# EAGLE design LilyPad_USB_Plus_Standalone (EAGLE 7.7.0)
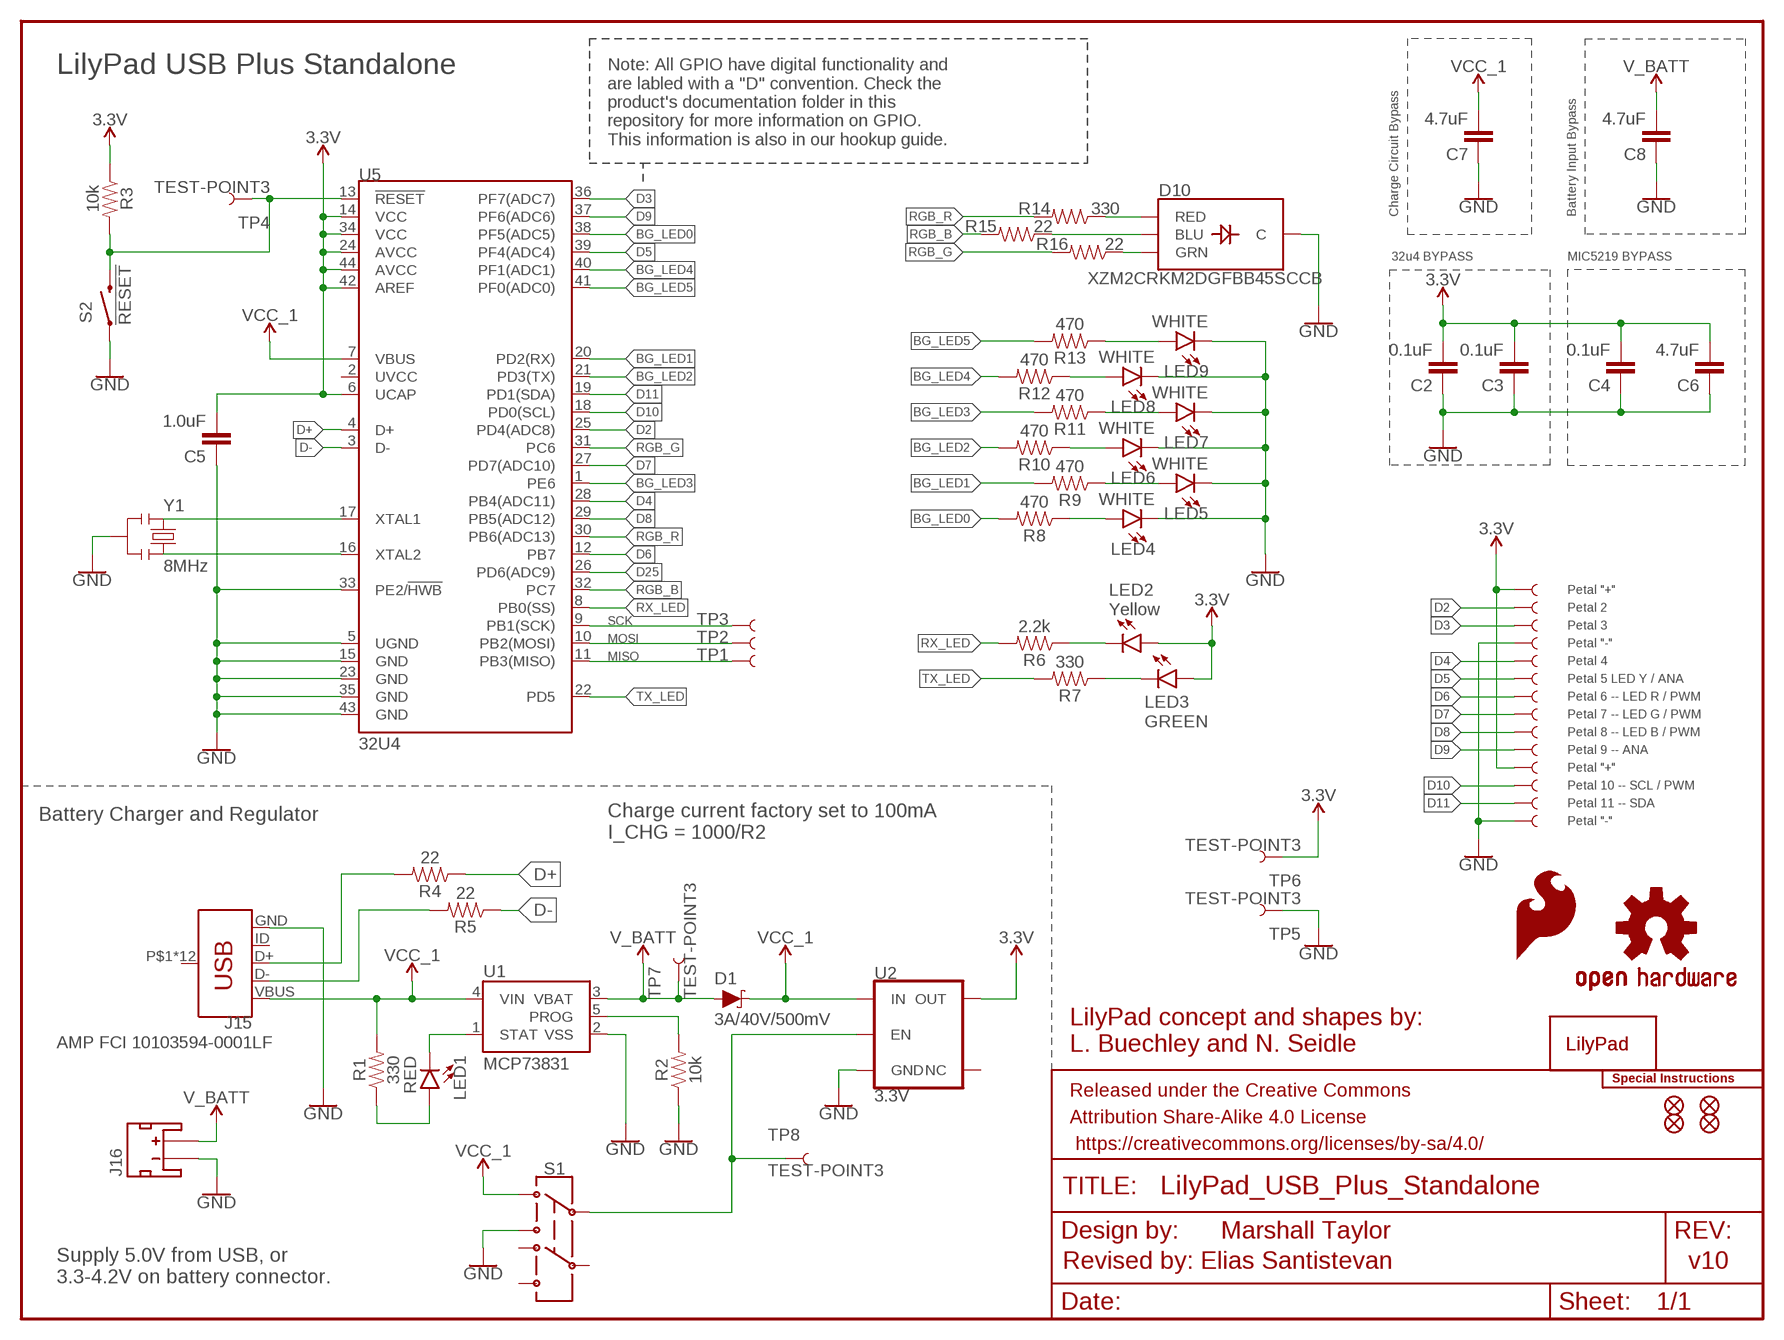
[diagram p0: schematic, sheet 1]

## Parts
C2  0.1uF  0.1UF-0402-16V-10%  [0402]
C3  0.1uF  0.1UF-0402-16V-10%  [0402]
C4  0.1uF  0.1UF-0402-16V-10%  [0402]
C5  1.0uF  1.0UF-0402-16V-10%  [0402]
C6  4.7uF  4.7UF0603  [0603]
C7  4.7uF  4.7UF0603  [0603]
C8  4.7uF  4.7UF0603  [0603]
D1  3A/40V/500mV  DIODE-SCHOTTKY-B340A  [SMA-DIODE]
D10  XZM2CRKM2DGFBB45SCCB  SUNLEDSMD1  [PLCC4SMDLED]
FRAME1  FRAME-LETTER  [CREATIVE_COMMONS]
J1  SEWTAP_LONG-2SIDE  [PETAL-LONG-1-2SIDE]
J2  SEWTAP_LONG-2SIDE  [PETAL-LONG-1-2SIDE]
J3  SEWTAP_LONG-2SIDE  [PETAL-LONG-1-2SIDE]
J4  SEWTAP_LONG-2SIDE  [PETAL-LONG-1-2SIDE]
J5  SEWTAP_LONG-2SIDE  [PETAL-LONG-1-2SIDE]
J6  SEWTAP_LONG-2SIDE  [PETAL-LONG-1-2SIDE]
J7  SEWTAP_LONG-2SIDE  [PETAL-LONG-1-2SIDE]
J8  SEWTAP_LONG-2SIDE  [PETAL-LONG-1-2SIDE]
J9  SEWTAP_LONG-2SIDE  [PETAL-LONG-1-2SIDE]
J10  SEWTAP_LONG-2SIDE  [PETAL-LONG-1-2SIDE]
J11  SEWTAP_LONG-2SIDE  [PETAL-LONG-1-2SIDE]
J12  SEWTAP_LONG-2SIDE  [PETAL-LONG-1-2SIDE]
J13  SEWTAP_LONG-2SIDE  [PETAL-LONG-1-2SIDE]
J14  SEWTAP_LONG-2SIDE  [PETAL-LONG-1-2SIDE]
J15  AMP FCI 10103594-0001LF  USB_MICRO-B_HALF_PTH  [USB-MICROB-PTH]
J16  JST_2MM_MALE  [JST-2-SMD]
JP1  FIDUCIALUFIDUCIAL  [MICRO-FIDUCIAL]
JP2  FIDUCIALUFIDUCIAL  [MICRO-FIDUCIAL]
JP3  FIDUCIALUFIDUCIAL  [MICRO-FIDUCIAL]
JP4  FIDUCIALUFIDUCIAL  [MICRO-FIDUCIAL]
LED1  RED  LED-RED0603  [LED-0603]
LED2  Yellow  LED-YELLOW0603  [LED-0603]
LED3  GREEN  LED-GREEN0603  [LED-0603]
LED4  WHITE  LED-WHITE0603  [LED-0603]
LED5  WHITE  LED-WHITE0603  [LED-0603]
LED6  WHITE  LED-WHITE0603  [LED-0603]
LED7  WHITE  LED-WHITE0603  [LED-0603]
LED8  WHITE  LED-WHITE0603  [LED-0603]
LED9  WHITE  LED-WHITE0603  [LED-0603]
LOGO1  SFE_LOGO_FLAME.2_INCH  [SFE_LOGO_FLAME_.2]
LOGO6  OSHW-LOGOS  [OSHW-LOGO-S]
R1  330  330OHM-0603-1/10W-1%  [0603]
R2  10k  10KOHM-0603-1/10W-1%  [0603]
R3  10k  10KOHM-0603-1/10W-1%  [0603]
R4  22  22OHM-0402-1/10W-1%  [0402]
R5  22  22OHM-0402-1/10W-1%  [0402]
R6  2.2k  2.2KOHM-0603-1/10W-1%  [0603]
R7  330  330OHM-0603-1/10W-1%  [0603]
R8  470  470OHM-0402-1/16W-5%  [0402]
R9  470  470OHM-0402-1/16W-5%  [0402]
R10  470  470OHM-0402-1/16W-5%  [0402]
R11  470  470OHM-0402-1/16W-5%  [0402]
R12  470  470OHM-0402-1/16W-5%  [0402]
R13  470  470OHM-0402-1/16W-5%  [0402]
R14  330  330OHM-0603-1/10W-1%  [0603]
R15  22  22OHM-0402-1/10W-1%  [0402]
R16  22  22OHM-0402-1/10W-1%  [0402]
S1  SWITCH-DPDT-SMD-AYZ0202  [SWITCH_DPDT_SMD_AYZ0202]
S2  !RESET  MOMENTARY-SWITCH-SPST-SMD-5.2-REDUNDANT  [TACTILE_SWITCH_SMD_5.2MM]
TP1  TEST-POINT3  [PAD.03X.03]
TP2  TEST-POINT3  [PAD.03X.03]
TP3  TEST-POINT3  [PAD.03X.03]
TP4  TEST-POINT3  [PAD.03X.03]
TP5  TEST-POINT3  [PAD.03X.03]
TP6  TEST-POINT3  [PAD.03X.03]
TP7  TEST-POINT3  [PAD.03X.03]
TP8  TEST-POINT3  [PAD.03X.03]
U1  MCP73831  [SOT23-5]
U2  3.3V  V_REG_AP2112K-3.3V  [SOT23-5]
U5  32U4  ATMEGA32U4_NOARDQFN3  [QFN-44-PAD_1:1-LESS_PASTE]
U$1  LILYLOGO_SHORT  [LILYPAD-WEARABLES_LOGO-LILYPAD]
U$13  LILYLOGO_SHORT  [LILYPAD-WEARABLES_LOGO-LILYPAD]
U$44  SPECIAL_INSTRUCTIONS-ORDERING  [ORDERING_INSTRUCTIONS]
Y1  8MHz  RESONATORSMD  [RESONATOR-SMD]

## Nets
3.3V: C2.2 C3.2 C4.2 C5.2 C6.2 J1.1 J11.1 LED2.A LED3.A R3.1 TP6.P$1 U2.5(OUT) U5.6(UCAP) U5.14(VCC) U5.24(AVCC) U5.34(VCC) U5.42(AREF) U5.44(AVCC)
BG_LED0: R8.2 U5.38(PF5(ADC5))
BG_LED1: R9.2 U5.20(PD2(RX))
BG_LED2: R10.2 U5.21(PD3(TX))
BG_LED3: R11.2 U5.1(PE6)
BG_LED4: R12.2 U5.40(PF1(ADC1))
BG_LED5: R13.2 U5.41(PF0(ADC0))
D2: J2.1 U5.25(PD4(ADC8))
D3: J3.1 U5.36(PF7(ADC7))
D4: J5.1 U5.28(PB4(ADC11))
D5: J6.1 U5.39(PF4(ADC4))
D6: J7.1 U5.12(PB7)
D7: J8.1 U5.27(PD7(ADC10))
D8: J9.1 U5.29(PB5(ADC12))
D9: J10.1 U5.37(PF6(ADC6))
D10: J12.1 U5.18(PD0(SCL))
D11: J13.1 U5.19(PD1(SDA))
D25: U5.26(PD6(ADC9))
D+: R4.1 U5.4(D+)
D-: R5.1 U5.3(D-)
GND: C2.1 C3.1 C4.1 C5.1 C6.1 C7.1 C8.1 D10.4(C) J4.1 J14.1 J15.GND J16.1(-) LED4.C LED5.C LED6.C LED7.C LED8.C LED9.C R2.1 S1.3 S2.1 S2.2 TP5.P$1 U1.2(VSS) U2.2(GND) U5.5(UGND) U5.15(GND) U5.23(GND) U5.33(PE2/!HWB) U5.35(GND) U5.43(GND) Y1.2
MISO: TP1.P$1 U5.11(PB3(MISO))
MOSI: TP2.P$1 U5.10(PB2(MOSI))
N$1: LED2.C R6.1
N$2: S1.2 TP8.P$1 U2.3(EN)
N$3: LED1.A R1.1
N$4: LED1.C U1.1(STAT)
N$5: U5.17(XTAL1) Y1.1
N$6: R2.2 U1.5(PROG)
N$7: U5.16(XTAL2) Y1.3
N$8: D10.2(GRN) R16.1
N$9: LED7.A R11.1
N$10: LED6.A R10.1
N$11: LED5.A R9.1
N$12: LED8.A R12.1
N$13: LED9.A R13.1
N$14: D10.3(BLU) R15.1
N$15: D10.1(RED) R14.1
N$18: LED4.A R8.1
N$19: J15.D- R5.2
N$20: J15.D+ R4.2
N$21: LED3.C R7.1
RESET: R3.2 S2.3 S2.4 TP4.P$1 U5.13(!RESET)
RGB_B: R15.2 U5.32(PC7)
RGB_G: R16.2 U5.31(PC6)
RGB_R: R14.2 U5.30(PB6(ADC13))
RX_LED: R6.2 U5.8(PB0(SS))
SCK: TP3.P$1 U5.9(PB1(SCK))
TX_LED: R7.2 U5.22(PD5)
V_BATT: C8.2 D1.A J16.2(+) TP7.P$1 U1.3(VBAT)
VCC_1: C7.2 D1.C J15.VBUS R1.2 S1.1 U1.4(VIN) U2.1(IN) U5.7(VBUS)
Unconnected: J15.ID J15.P$1(SHIELD) J15.P$2(SHIELD) J15.P$3(SHIELD) J15.P$4(SHIELD) J15.P$6(SHIELD) J15.P$8(SHIELD) J15.P$10(SHIELD) J15.P$12(SHIELD) J15.SHEILD2(SHIELD) J15.SHIELD J15.SHIELD3(SHIELD) J15.SHIELD4(SHIELD) J16.NC1(PAD1) J16.NC2(PAD2) S1.4 S1.5 S1.6 U2.4(NC) U5.2(UVCC)

## Notes on the sheet
- LilyPad USB Plus Standalone
- Note: All GPIO have digital functionality and 
  are labled with a "D" convention. Check the 
  product's documentation folder in this 
  repository for more information on GPIO. 
  This information is also in our hookup guide.
- Charge Circuit Bypass | Battery Input Bypass
- 32u4 BYPASS | MIC5219 BYPASS
- Petal "+"
- Petal 2
- Petal 3
- Petal "-"
- Petal 4
- Petal 5 LED Y / ANA
- Petal 6 -- LED R / PWM
- Petal 7 -- LED G / PWM
- Petal 8 -- LED B / PWM
- Petal 9 -- ANA
- Petal "+"
- Petal 10 -- SCL / PWM
- Petal 11 -- SDA
- Battery Charger and Regulator | Petal "-"
- Charge current factory set to 100mA
  I_CHG = 1000/R2
- LilyPad concept and shapes by:
  L. Buechley and N. Seidle
- Marshall Taylor
- Revised by: Elias Santistevan | v10
- Supply 5.0V from USB, or
  3.3-4.2V on battery connector.

## Library data of the parts
C2-C4 = SparkFun-Capacitors:0.1UF: 0.1µF ceramic capacitors A capacitor is a passive two-terminal electrical component used to store electrical energy temporarily in an electric field.; PROD_ID: CAP-12416
C5 = SparkFun-Capacitors:1.0UF: 1µF ceramic capacitors A capacitor is a passive two-terminal electrical component used to store electrical energy temporarily in an electric field.; PROD_ID: CAP-12417
C6-C8 = SparkFun-Capacitors:4.7UF: 4.7µF ceramic capacitors A capacitor is a passive two-terminal electrical component used to store electrical energy temporarily in an electric field.; PROD_ID: CAP-08280
D1 = SparkFun-DiscreteSemi:DIODE-SCHOTTKY: Schottky diode A Schottky diode is a semiconductor diode which has a low forward voltage drop and a very fast switching action.; PROD_ID: DIO-09886
D10 = SparkFun-LED:SUNLED: LED-RGB Common Cathode XZM2CRKM2DGFBB45SCCB Packages: PLCC4 SparkFun Products: Lilypad Prototyping Board <[https://www.sparkfun.com/products/9264]>; PROD_ID: DIO-13722
FRAME1 = SparkFun-Aesthetics:FRAME-LETTER: Schematic Frame - Letter Standard 8.5x11 US Letter frame
J1-J14 = LilyPad-Wearables:SEWTAP: SparkFun LilyPad Sew Taps Sewable connection points for LilyPad Boards SparkFun Products: LilyPad Arduino 328 Main Board <https://www.sparkfun.com/products/13342> LilyTiny <https://www.sparkfun.com/products/10899> LilyPad Power Supply <https://www.sparkfun.com/products/11259>
J15 = SparkFun-Connectors:USB_MICRO-B: USB Type Micro-B Connector Male/female and PTH/SMT variants SparkFun Products: SparkFun microB USB Breakout <https://www.sparkfun.com/products/12035> SparkFun USB microB Plug Breakout <https://www.sparkfun.com/products/10031> SparkFun ESP8266 Thing <https://www.sparkfun.com/products/13231>; PROD_ID: CONN-13711
J16 = SparkFun-Connectors:JST_2MM_MALE: JST 2MM MALE RA CONNECTOR Two pin, compact surface mount connector. Commonly used as a battery input connection point. We really like the solid locking feeling and high current rating on these small connectors. We use these all the time as battery connectors. Mates to single-cell LiPo batteries. Here is the connector we sell at SparkFun: JST Right Angle Connector - White <https://www.sparkfun.com/products/8612> (PRT-08612) Datasheet <http://www.sparkfun.com/datasheets/Prototyping/Connectors/JST-Horizontal.pdf> It was used on these SparkFun products: SparkFun MOSFET Power Controller <https://www.sparkfun.com/products/11214> (PRT-11214) SparkFun Battery Babysitter - LiPo Battery Manager <https://www.sparkfun.com/products/13777> (PRT-13777) And many, many others that required a lipo battery connection.; PROD_ID: CONN-11443; SF_ID: PRT-08612
JP1-JP4 = SparkFun:FIDUCIAL: Fiducial Alignment Points Various fiducial points for machine vision alignment.
LED1 = SparkFun-LED:LED-RED: Red SMD LED Used in manufacturing of most products at SparkFun Packages: 0603 - SMD 0603 package [Product Link] <http://docs.avagotech.com/docs/AV02-0551EN> 0603 SMART - SMD 0603 SMART package ( more efficient and expensive)[Product Link] <http://www.osram-os.com/Graphics/XPic2/00077099_0.pdf> 1206 - SMD1206 package [Product Link] <https://www.sparkfun.com/datasheets/DevTools/LilyPad/Q150OVS4.pdff> SparkFun Products: Pro Mini 328 -5V <https://www.sparkfun.com/products/821> RedBoard <https://www.sparkfun.com/products/12757> IOIO-OTG <https://www.sparkfun.com/products/13613>; PROD_ID: DIO-00819
LED2 = SparkFun-LED:LED-YELLOW: Yellow SMD LED Used in manufacturing several products at SparkFun. Packages: 0603 - SMD 0603 package[Product Link] <http://www.kingbrightusa.com/product.asp?catalog_name=LED&product_id=APT1608SYCK> 0603 -SMART - SMART SMD 0603 package (more efficient/more expensive) [Product Link] <http://www.osram-os.com/osram_os/en/products/product-catalog/led-light-emitting-diodes/smartled-0603/ly-l29k/index.jsp> LilyPad - SMD1206 package[Product Datasheet] <https://www.sparkfun.com/datasheets/DevTools/LilyPad/Q150YUS4.pdf> SparkFun Products: Blynk Board <https://www.sparkfun.com/products/13794> IOIO-OTG <https://www.sparkfun.com/products/13613> XBee Explorer Serial <https://www.sparkfun.com/products/13225>; PROD_ID: DIO-09003
LED3 = SparkFun-LED:LED-GREEN: Green SMD LED Used in manufacturing of various products at SparkFun Packages: 0603 - SMD 0603 package [Product Link] <http://www.futureelectronics.com/en/technologies/semiconductors/optoelectronics/leds/Pages/9894312-LTST-C190GKT.aspx?CrossPart=HSMG-C190&IM=0> LilyPad 1206 - SMD1206 LilyPad package [Product Link] <http://www.futureelectronics.com/en/Technologies/Product.aspx?ProductID=IN150NGHARVATEKCORPORATION2049943&IM=0> 1206 - SMD1206 package [Product Link] <http://www.futureelectronics.com/en/technologies/semiconductors/optoelectronics/leds/Pages/8315665-LTST-C150KGKT.aspx?IM=0> 1206 Bottom Mount -SMD 1206 Bottom Mount [Product Link] <http://www.digikey.com/product-detail/en/lite-on-inc/LTST-C230KGKT/160-1456-1-ND/386854> SparkFun Products: Pro Mini 328 -5V <https://www.sparkfun.com/products/821> RedBoard <https://www.sparkfun.com/products/12757> MP3 Trigger <https://www.sparkfun.com/products/13720> Makey Makey <https://www.sparkfun.com/products/11076>; PROD_ID: DIO-00821
LED4-LED9 = SparkFun-LED:LED-WHITE: White SMD LED Used in manufacturing several products at SparkFun. Packages: 0603 - Bright White SMD 0603 package[Product Link] <http://www.kingbrightusa.com/product.asp?catalog_name=LED&product_id=APT1608QWF/D> 1206 - Bright White SMD1206 package [Product Link] <http://www.kingbrightusa.com/product.asp?catalog_name=LED&product_id=APT3216QWF/D> 3014 - Super Bright SMD 3014 package [Datasheet] <http://www.lumileds.com/uploads/459/DS208-pdf> SparkFun Products: Blackberry Trackballer Breakout <https://www.sparkfun.com/products/13169> Digital SandBox <https://www.sparkfun.com/products/12651>; PROD_ID: DIO-09004
LOGO1 = SparkFun-Aesthetics:SFE_LOGO_FLAME: SparkFun Flame Logo This is the SparkFun flame logo. The logo on the schematic will always be the same size; the package variant is the height of the flame. Default layer for the logo on the board is tSilk.
LOGO6 = SparkFun-Aesthetics:OSHW-LOGO: Open-Source Hardware (OSHW) Logo This logo indicates the piece of hardware it is found on incorporates a OSHW license and/or adheres to the definition of open source hardware found here: http://freedomdefined.org/OSHW
R1 R7 R14 = SparkFun-Resistors:330OHM: 330Ω resistor A resistor is a passive two-terminal electrical component that implements electrical resistance as a circuit element. Resistors act to reduce current flow, and, at the same time, act to lower voltage levels within circuits. - Wikipedia; PROD_ID: RES-00818
R2 R3 = SparkFun-Resistors:10KOHM: 10kΩ resistor A resistor is a passive two-terminal electrical component that implements electrical resistance as a circuit element. Resistors act to reduce current flow, and, at the same time, act to lower voltage levels within circuits. - Wikipedia; PROD_ID: RES-00824
R4 R5 R15 R16 = SparkFun-Resistors:22OHM: 22Ω resistor A resistor is a passive two-terminal electrical component that implements electrical resistance as a circuit element. Resistors act to reduce current flow, and, at the same time, act to lower voltage levels within circuits. - Wikipedia; PROD_ID: RES-12427
R6 = SparkFun-Resistors:2.2KOHM: 2.2kΩ resistor A resistor is a passive two-terminal electrical component that implements electrical resistance as a circuit element. Resistors act to reduce current flow, and, at the same time, act to lower voltage levels within circuits. - Wikipedia; PROD_ID: RES-08272
R8-R13 = SparkFun-Resistors:470OHM: 470Ω resistor A resistor is a passive two-terminal electrical component that implements electrical resistance as a circuit element. Resistors act to reduce current flow, and, at the same time, act to lower voltage levels within circuits. - Wikipedia; PROD_ID: RES-13829
S1 = SparkFun-Switches:SWITCH-DPDT: Double-Pole, Double-Throw (DPDT) Switch Double-pole, double-throw switches. Variant Overview PTH-GPI-152-3013 Used on SparkFun Geiger Counter <https://www.sparkfun.com/products/11345> SMD-AY0202 Surface Mount DPDT Switch <https://www.sparkfun.com/products/597> (COM-00597) Used on e.g. LilyPad Arduino USB - ATmega32U4 Board <https://www.sparkfun.com/products/12049>; PROD_ID: SWCH-08179; SF_SKU: COM-00597
S2 = SparkFun-Switches:MOMENTARY-SWITCH-SPST: Momentary Switch (Pushbutton) - SPST Normally-open (NO) SPST momentary switches (buttons, pushbuttons). Variants PTH-12MM - 12mm square, through-hole Momentary Pushbutton Switch - 12mm Square <https://www.sparkfun.com/products/9190> (COM-09190) PTH-6.0MM, PTH-6.0MM-KIT - 6.0mm square, through-hole Mini Pushbutton Switch <https://www.sparkfun.com/products/97> (COM-00097) KIT package intended for soldering kit's - only one side of pads' copper is exposed. PTH-RIGHT-ANGLE-KIT - Right-angle, through-hole Right Angle Tactile Button <https://www.sparkfun.com/products/10791> - Used on SparkFun BigTime Watch Kit <https://www.sparkfun.com/products/11734> SMD-12MM - 12mm square, surface-mount Tactile Button - SMD (12mm) <https://www.sparkfun.com/products/12993> (COM-12993) Used on SparkFun PicoBoard <https://www.sparkfun.com/products/11888> SMD-4.5MM - 4.5mm Square Trackball Switch Used on SparkFun Blackberry Trackballer Breakout <https://www.sparkfun.com/products/13169> SMD-4.6MMX2.8MM - 4.60mm x 2.80mm, surface mount Used on SparkFun SAMD21 Mini Breakout <https://www.sparkfun.com/products/13664> SMD-5.2MM, SMD-5.2-REDUNDANT - 5.2mm square, surface-mount Mini Pushbutton Switch - SMD <https://www.sparkfun.com/products/8720> (COM-08720) Used on Arduino Pro Mini <https://www.sparkfun.com/products/11114> REDUNDANT package connects both switch circuits together SMD-6.0X3.5MM - 6.0 x 3.5mm, surface mount Momentary Reset Switch SMD <https://www.sparkfun.com/products/8229> (COM-08229) SMD-6.2MM-TALL - 6.2mm square, surface mount Tactile Button - SMD (6mm) <https://www.sparkfun.com/products/12992> Used on SparkFun Digital Sandbox <https://www.sparkfun.com/products/12651> SMD-RIGHT-ANGLE - Right-angle, surface mount Used on SparkFun Block for Intel® Edison - Arduino <https://www.sparkfun.com/products/13036>; PROD_ID: SWCH-08247; SF_SKU: COM-08720
TP1-TP8 = SparkFun-Connectors:TEST-POINT: SparkFun Test Points Bare copper test points for troubleshooting or In-Circuit-Testing. These are used by our Production team for verifying production board runs using pogo-pins on test beds. SparkFun Products: SparkFun LSM9DS1 Breakout <https://www.sparkfun.com/products/13284> SparkFun PSOC <https://www.sparkfun.com/products/13714> SparkFun Load Cell Amplifier <https://www.sparkfun.com/products/13879>
U1 = SparkFun-PowerIC:MCP73831: Miniature single cell, fully integrated Li-Ion, Li-polymer charge management controller http://ww1.microchip.com/downloads/en/DeviceDoc/21984a.pdf; PROD_ID: IC-09995
U2 = SparkFun-IC-Power:V_REG_AP2112: AP2112 - 600mA CMOS LDO Regulator w/ Enable The AP2112 is CMOS process low dropout linear regulator with enable function, the regulator delivers a guaranteed 600mA (min.) continuous load current. Features Output Voltage Accuracy: ±1.5% Output Current: 600mA (Min.) Foldback Short Current Protection: 50mA Enable Function to Turn ON/OFF VOUT Low Dropout Voltage (3.3V): 250mV (Typ.) @IOUT=600mA Excellent Load Regulation: 0.2%/A (Typ.) Excellent Line Regulation: 0.02%/V (Typ.) Low Quiescent Current: 55μA (Typ.) Low Standby Current: 0.01μA (Typ.) Low Output Noise: 50μVRMS PSRR: 100Hz -65dB, 1kHz -65dB OTSD Protection Stable with 1.0μF Flexible Cap: Ceramic, Tantalum and Aluminum Electrolytic Operation Temperature Range: -40°C to 85°C ESD: MM 400V, HBM 4000V; PROD_ID: VREG-12457
U5 = SparkFun-IC-Microcontroller:ATMEGA32U4_NOARD: Atmel MCU, 32KByte Atmel 44-pin 8-bit Microcontroller with 32KBytes of ISP Flash and USB Controller Datasheet <http://cdn.sparkfun.com/datasheets/Dev/Arduino/Boards/ATMega32U4.pdf> SparkFun Products LilyPad Arduino USB - ATmega32U4 Board <https://www.sparkfun.com/products/12049> (DEV-12049) Pro Micro - 5V/16MHz <https://www.sparkfun.com/products/12640> (DEV-12640) Pro Micro - 3.3V/8MHz <https://www.sparkfun.com/products/12587> (DEV-12587) Fio v3 - ATmega32U4 <https://www.sparkfun.com/products/11520> (DEV-11520) Qduino Mini <https://www.sparkfun.com/products/13614> (DEV-13614) Makey Makey - Standard Kit <https://www.sparkfun.com/products/11511> (WIG-11511) Makey Makey Deluxe Kit <https://www.sparkfun.com/products/11519> (WIG-11519); PROD_ID: IC-10828
U$1 U$13 = newLilypadParts:LILYLOGO_SHORT
U$44 = SparkFun-Aesthetics:SPECIAL_INSTRUCTIONS: Special Ordering/Production Instructions Alert Symbol for special PCB ordering instructions or unique production process warnings. Ordering Instructions Production Instructions Types of information that should be added to box: Copper weight Soldermask color Silk color PCB thickness Number of layers PCB Standard: 1.6mm FR4 1 oz copper immersion silver plating red soldermask white silkscreen Types of information that should be added to box: Special wash requirements Depaneling instructions Humidification Glue curing Default text settings: 0.07 inch 9% ratio 50% line distance
Y1 = SparkFun-FreqCtrl:RESONATOR: Resonator Small SMD resonator. This is the itty bitty 10/20MHz resonators with built in caps. CSTCE10M0G55 and CSTCE20M0V53. Footprint has been reviewed closely but hasn't been tested yet.; PROD_ID: XTAL-08895

## Board
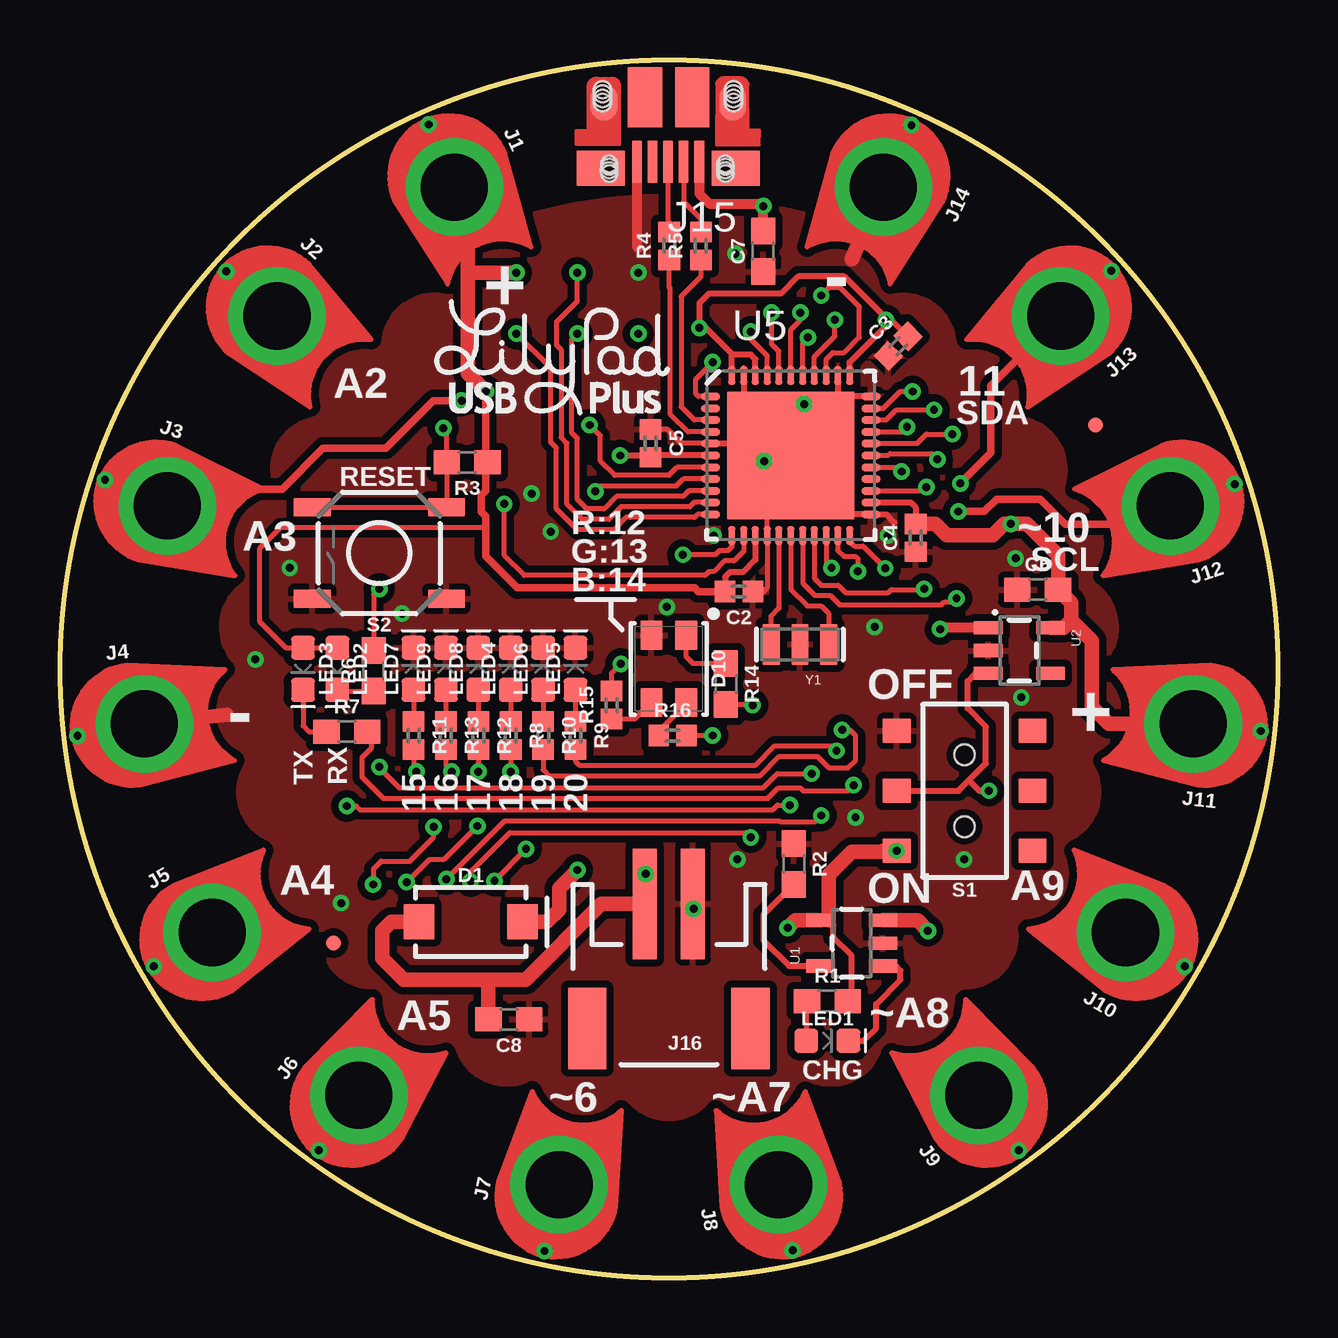
[diagram p1: board, top side]
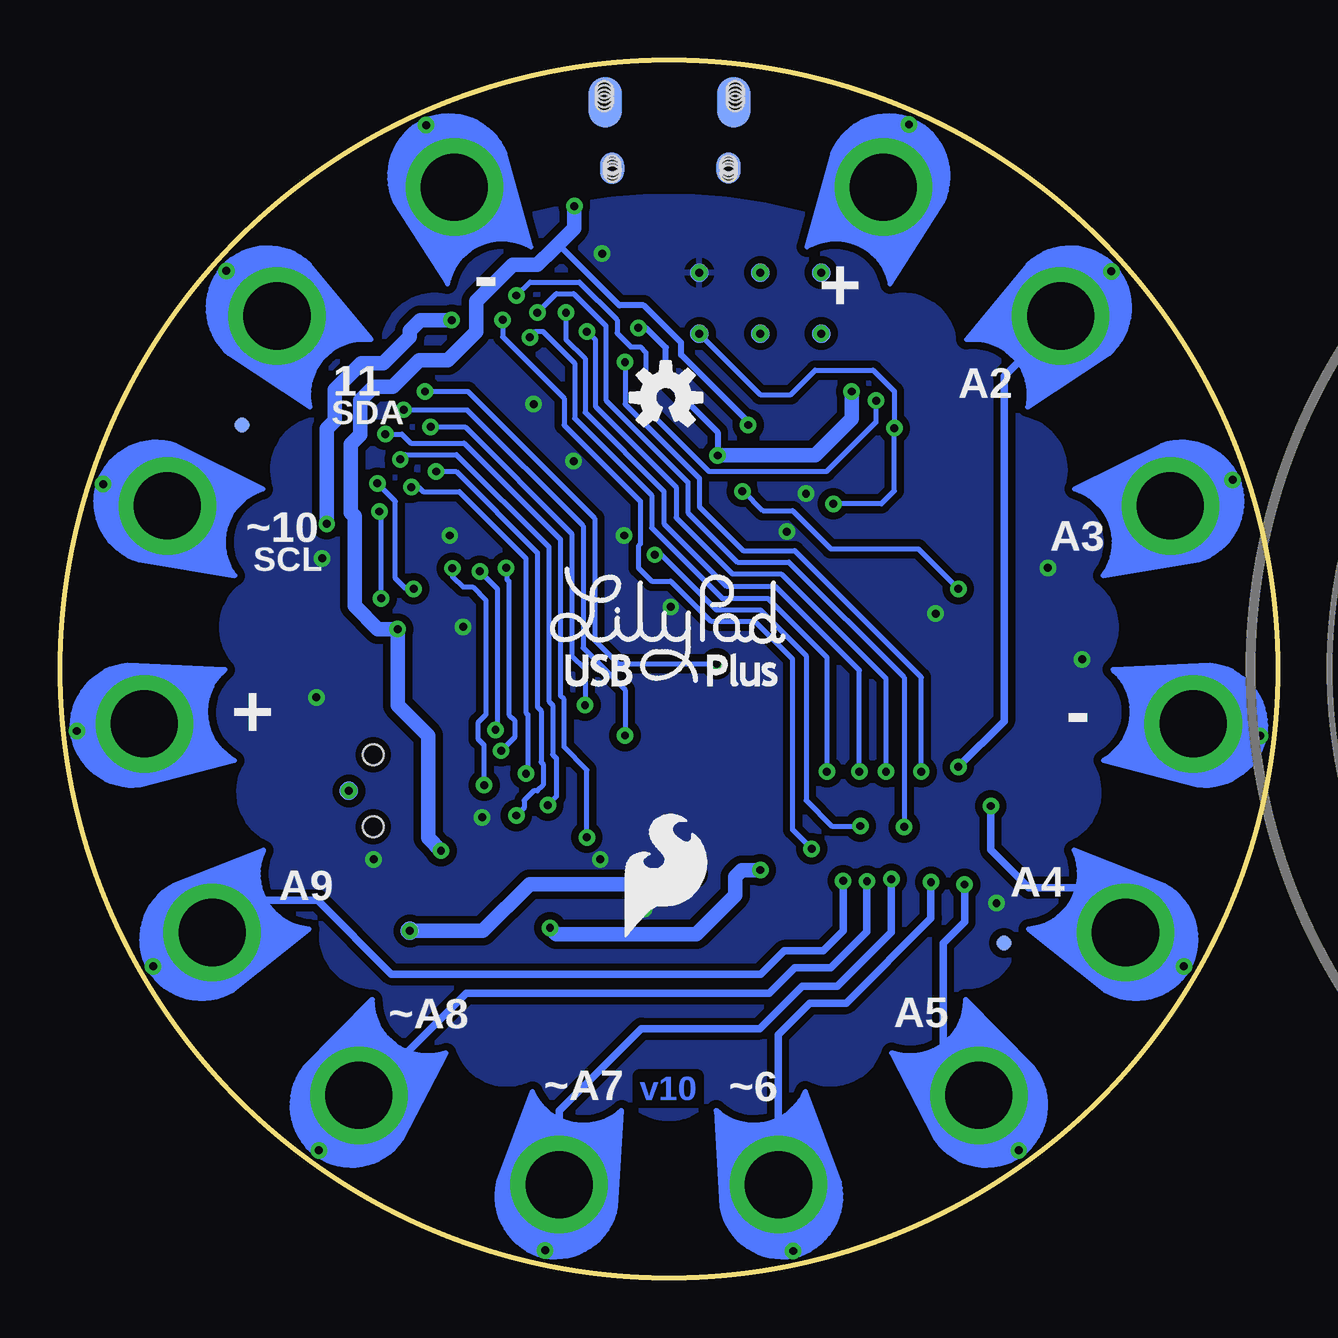
[diagram p2: board, bottom side, seen from below]

Size 50.74 x 50.74 mm. Coordinates in mm from the lower left corner, seen from the top.
Outline: circle at 25.37,25.37 radius 25.37
Copper layers (1*16): Top 0.035mm / dielectric 1.5mm / Bottom 0.035mm
Design rules "SparkFun-2-layer-TIGHT *": minimum track width 7mil, minimum drill 15mil, track to track 8mil, track to pad 8mil, pad to pad 8mil, via to via 8mil, smd to smd 8mil, copper to edge 7mil, drill to drill 7mil, minimum pad ring 7mil, minimum via ring 7mil, stop-mask expansion 4mil, vias tented up to drill 25mil, thermal gap 10mil
tRestrict: area 18.3,44.8 to 32.4,50.5; 1 lines
bRestrict: area 18.3,44.8 to 32.4,50.5; 1 lines

### Footprints (pad centres in the part's own frame; a part is rotated, then mirrored left to right if it is on the bottom)
0402 = smd 0.85 x 0.9: 1 -0.58,0; 2 0.58,0
0603 = smd 1.1 x 1: 1 -0.85,0; 2 0.85,0
SMA-DIODE = smd 1.27 x 1.47: A -2.15,0; C 2.15,0
PLCC4SMDLED = smd 1.2 x 0.9: 1 -1.4,0.725; 2 1.4,0.725; 3 1.4,-0.725; 4 -1.4,-0.725
PETAL-LONG-1-2SIDE = drill 2.794 pad 4.064: 1 0.03,0
USB-MICROB-PTH = smd 0.4 x 1.75: D+ 0.031,1.331; D- -0.619,1.331; GND 1.331,1.331; ID 0.681,1.331; VBUS -1.269,1.331 | smd 1.4 x 2.1 bottom: P$1 2.701,-1.142; P$3 -2.659,-1.144 | smd 1 x 1.3: P$2 2.487,1.594; P$6 -2.368,1.604 | smd 1 x 1.3 bottom: P$4 -2.368,1.604; P$10 2.481,1.598 | smd 1.1 x 1.5: P$8 2.701,-1.142; P$12 -2.659,-1.144 | smd 2 x 1.46: SHEILD2 2.831,1.606; SHIELD -2.794,1.606 | smd 1.425 x 2.5: SHIELD3 -0.979,-1.349; SHIELD4 0.996,-1.352 | hole 0.7: -2.693,-1.134; -2.693,-1.3; -2.694,-1.499; -2.694,-1.664; 2.768,-1.134; 2.767,-1.303; 2.766,-1.496; 2.766,-1.664 | hole 0.66: -2.359,1.821; -2.349,1.691; -2.359,1.541; -2.354,1.432; 2.481,1.821; 2.491,1.691; 2.481,1.541; 2.486,1.432
JST-2-SMD = smd 1 x 4.6: 1 -1,-3.7; 2 1,-3.7 | smd 1.6 x 3.4: NC1 -3.4,1.5; NC2 3.4,1.5
MICRO-FIDUCIAL = smd 0.635 x 0.635: 1 0,0
LED-0603 = smd 1 x 1: A -0.877,0; C 0.877,0
SWITCH_DPDT_SMD_AYZ0202 = smd 1 x 1.15: 1 -2.5,2.825; 2 0,2.825; 3 2.5,2.825; 4 -2.5,-2.825; 5 0,-2.825; 6 2.5,-2.825 | hole 0.85: 1.5,0; -1.5,0
TACTILE_SWITCH_SMD_5.2MM = smd 1.524 x 0.762: 1 -2.794,1.905; 2 2.794,1.905; 3 -2.794,-1.905; 4 2.794,-1.905
PAD.03X.03 = smd 0.762 x 0.762: P$1 0,0
SOT23-5 = smd 0.55 x 1.2: 1 -0.95,-1.3; 2 0,-1.3; 3 0.95,-1.3; 4 0.95,1.3; 5 -0.95,1.3
QFN-44-PAD_1:1-LESS_PASTE = smd 0.8 x 0.3: 1 -3.337,2.458; 2 -3.337,1.958; 3 -3.337,1.479; 4 -3.337,0.979; 5 -3.337,0.5; 6 -3.337,0; 7 -3.337,-0.5; 8 -3.337,-0.979; 9 -3.337,-1.479; 10 -3.337,-1.958; 11 -3.337,-2.458; 23 3.337,-2.458; 24 3.337,-1.958; 25 3.337,-1.479; 26 3.337,-0.979; 27 3.337,-0.5; 28 3.337,0; 29 3.337,0.5; 30 3.337,0.979; 31 3.337,1.479; 32 3.337,1.958; 33 3.337,2.458 | smd 0.3 x 0.8: 12 -2.458,-3.337; 13 -1.958,-3.337; 14 -1.479,-3.337; 15 -0.979,-3.337; 16 -0.5,-3.337; 17 0,-3.337; 18 0.5,-3.337; 19 0.979,-3.337; 20 1.479,-3.337; 21 1.958,-3.337; 22 2.458,-3.337; 34 2.458,3.337; 35 1.958,3.337; 36 1.479,3.337; 37 0.979,3.337; 38 0.5,3.337; 39 0,3.337; 40 -0.5,3.337; 41 -0.979,3.337; 42 -1.479,3.337; 43 -1.958,3.337; 44 -2.458,3.337 | smd 5.3 x 5.3: EPAD 0,0
RESONATOR-SMD = smd 0.7 x 1.7: 1 -1.2,0; 2 0,0; 3 1.2,0

### Placement (x,y rotation side)
C2  28.29,28.59 180 top
C3  34.93,38.81 45 top
C4  35.66,30.83 90 top
C5  24.61,34.77 270 top
C6  40.74,28.67 0 top
C7  29.31,42.77 90 top
C8  18.7,10.76 180 top
D1  17.11,14.83 0 top
D10  25.37,25.37 270 top
FRAME1  20.67,-11.46 0 top  (outside the outline)
J1  16.42,45.47 294 top
J2  9.02,40.09 318 top
J3  4.45,32.17 342 top
J4  3.49,23.07 6 top
J5  6.32,14.37 30 top
J6  12.44,7.57 54 top
J7  20.79,3.85 78 top
J8  29.94,3.85 102 top
J9  38.3,7.57 126 top
J10  44.42,14.37 150 top
J11  47.25,23.07 174 top
J12  46.29,32.17 198 top
J13  41.72,40.09 222 top
J14  34.32,45.47 246 top
J15  25.37,47.83 180 top
J16  25.37,11.87 180 top
JP1  11.4,13.94 0 bottom
JP2  11.4,13.94 0 top
JP3  43.15,35.53 0 top
JP4  43.15,35.53 0 bottom
LED1  31.97,9.87 0 top
LED2  11.56,25.37 270 top
LED3  10.13,25.37 270 top
LED4  18.78,25.37 90 top
LED5  21.48,25.37 90 top
LED6  20.13,25.37 90 top
LED7  14.73,25.37 90 top
LED8  17.43,25.37 90 top
LED9  16.08,25.37 90 top
LOGO1  27.53,13.94 0 bottom
LOGO6  25.5,36.67 0 bottom
R1  31.97,11.53 0 top
R2  30.58,17.24 270 top
R3  16.96,33.98 180 top
R4  25.38,42.99 90 top
R5  26.7,42.99 90 top
R6  13.07,25.29 90 top
R7  11.95,22.75 0 top
R8  18.78,22.59 270 top
R9  21.48,22.59 270 top
R10  20.13,22.59 270 top
R11  14.73,22.59 270 top
R12  17.43,22.59 270 top
R13  16.08,22.59 270 top
R14  27.75,24.73 270 top
R15  22.99,23.86 90 top
R16  25.53,22.59 0 top
S1  37.69,20.29 90 top
S2  13.3,30.19 180 top
TP1  19.02,39.34 0 bottom
TP2  21.56,41.88 0 bottom
TP3  21.56,39.34 0 bottom
TP4  24.1,39.34 0 bottom
TP5  24.1,41.88 0 bottom
TP6  19.02,41.88 0 bottom
TP7  36.16,14.45 0 bottom
TP8  38.7,20.29 0 bottom
U1  32.99,13.94 90 top
U2  39.97,26.13 270 top
U5  30.45,34.26 0 top
U$1  25.37,27.55 0 bottom
U$3  [PETAL_PAD_OFF]  16.42,45.47 294 top
U$7  [PETAL_SPACE_OFF]  16.42,45.47 294 top
U$8  [PETAL_SPACE_OFF]  44.42,14.37 150 top
U$9  [PETAL_PAD_OFF]  44.42,14.37 150 top
U$10  [PETAL_SPACE_OFF]  46.29,32.17 198 top
U$11  [PETAL_PAD_OFF]  46.29,32.17 198 top
U$12  [PETAL_SPACE_OFF]  47.25,23.07 174 top
U$13  20.55,38.69 0 top
U$15  [PETAL_PAD_OFF]  47.25,23.07 174 top
U$16  [PETAL_SPACE_OFF]  41.72,40.09 222 top
U$17  [PETAL_PAD_OFF]  41.72,40.09 222 top
U$18  [PETAL_SPACE_OFF]  20.79,3.85 78 top
U$19  [PETAL_PAD_OFF]  12.44,7.57 54 top
U$20  [PETAL_SPACE_OFF]  12.44,7.57 54 top
U$21  [PETAL_PAD_OFF]  20.79,3.85 78 top
U$22  [PETAL_SPACE_OFF]  29.94,3.85 102 top
U$23  [PETAL_PAD_OFF]  29.94,3.85 102 top
U$24  [PETAL_SPACE_OFF]  38.3,7.57 126 top
U$25  [PETAL_PAD_OFF]  38.3,7.57 126 top
U$26  [PETAL_SPACE_OFF]  9.02,40.09 318 top
U$27  [PETAL_PAD_OFF]  9.02,40.09 318 top
U$28  [PETAL_SPACE_OFF]  4.45,32.17 342 top
U$29  [PETAL_PAD_OFF]  4.45,32.17 342 top
U$30  [PETAL_SPACE_OFF]  3.49,23.07 6 top
U$31  [PETAL_PAD_OFF]  3.49,23.07 6 top
U$32  [PETAL_SPACE_OFF]  6.32,14.37 30 top
U$33  [PETAL_PAD_OFF]  6.32,14.37 30 top
U$34  [PETAL_PAD_OFF]  34.32,45.47 246 top
U$44  3.78,-19.08 0 top  (outside the outline)
Y1  30.83,26.38 180 top

### Tracks (layer width: path | path; a pad name or v marks a point on that pad's centre or on a via)
3.3V  (via drill 0.33, 0.33 pad 0.51)
  Top 0.203: 17.75,31.24 9.18,31.24 8.3,30.37 8.3,27.35 9.41,26.25 LED3.A | LED3.A | LED3.A LED2.A | R3.1 17.81,34.19 17.75,34.26
  Top 0.254: C4.2 35.66,32.1 35.45,32.3 U5.24 | C4.2 | C2.2 27.71,29.2 27.91,29.4 28.46,29.4 28.97,29.91 U5.14 | 28.03,38.47 28.78,38.47 28.97,38.28 U5.42 | 28.03,38.47 26.92,39.58 v26.64,39.58 26.64,40.61 27.04,41.01 30.05,41.01 30.77,41.72 32.67,41.72 34.42,39.97 v34.42,39.89 | v34.42,39.89 34.42,39.66 32.91,38.14 U5.34 | C3.2 34.67,39.89 v34.42,39.89 | U5.44 27.99,38.43 28.03,38.47 | U5.6 24.68,34.26 C5.2 24.53,34.26 v23.34,34.26
  Top 0.305: J1.1 16.99,44.89 | C2.2 26.59,28.59 26.44,28.74 19.06,28.74 17.75,30.05 17.75,31.24 17.75,31.72 17.55,31.92 17.55,32.59 17.75,32.79 17.75,34.26 v17.75,36.93
  Top 0.61: U2.5 41.81,27.08 42.13,27.4 | 42.13,27.4 42.13,28.12 C6.2 41.59,30.11 40.28,31.41 v39.62,31.41 39.35,31.41 38.86,30.92 36.96,30.92 36.47,31.41 C4.2 | 16.99,44.89 16.99,41.88 | 16.99,41.88 16.99,37.69 v17.75,36.93 | TP6.P$1 16.99,41.88 | J11.1 43.7,23.07 42.99,23.78 42.99,26.54 42.13,27.4
  Bottom 0.254: v23.34,34.26 23.34,35.23 25.5,37.39 25.5,38.75 26.32,39.58 v26.64,39.58
  Bottom 0.406: J1.1 v15.36,48.05 | v50.03,22.78 J11.1
  Bottom 0.61: v17.75,36.93 17.75,35.78 19.27,34.26 v23.34,34.26 | v39.62,31.41 39.62,35.37 39.29,35.7 39.29,36.99 38.18,38.1 37.27,38.1 36.16,39.21 36.16,39.47 35.73,39.89 v34.42,39.89
  other vias: 19.02,41.88
BG_LED0  (via drill 0.33)
  Top 0.203: R8.2 v18.78,21.08 | U5.38 30.95,38.97 v31.16,39.18
  Bottom 0.203: v31.16,39.18 30.92,39.42 30.61,39.42 29.3,38.11 29.3,35.81 26.08,32.59 26.08,31.24 23.15,28.31 21.24,28.31 18.78,25.84 v18.78,21.08
BG_LED1  (via drill 0.33)
  Top 0.203: R9.2 21.48,21.52 21.64,21.36 28.98,21.36 29.77,22.15 32.16,22.15 v32.35,21.96 | 31.95,29.77 v32.15,29.58 31.93,29.8 U5.20
  Bottom 0.203: v32.15,29.58 32.12,29.54 32.12,29.1 32.04,29.02 32.04,23.46 31.8,23.23 31.8,22.51 v32.35,21.96
BG_LED2  (via drill 0.33)
  Top 0.203: 33.24,29.56 v33.24,29.43 33.24,29.96 33.15,30.05 32.67,30.05 32.41,30.32 U5.21 | R10.2 20.13,21.16 20.37,20.92 29.18,20.92 29.97,21.72 31.56,21.72 32.04,21.24 32.83,21.24 33.15,21.56 33.15,22.59 32.91,22.83 v32.59,22.83
  Bottom 0.203: v33.24,29.43 32.51,28.7 32.51,22.91 v32.59,22.83
BG_LED3  (via drill 0.33)
  Top 0.203: R11.2 14.73,21.2 v14.85,21.08 | 27.19,38.12 v27.19,38.15 26.48,37.43 26.48,36.84 26.6,36.72 U5.1
  Bottom 0.203: v27.19,38.15 27.19,36.4 24.1,33.31 24.1,32.12 22.27,30.29 20.13,30.29 14.85,25.01 v14.85,21.08
BG_LED4  (via drill 0.33)
  Top 0.203: v29.65,40.21 29.65,38.9 29.95,38.61 U5.40 | R12.2 v17.43,21.08
  Bottom 0.203: v29.65,40.21 29.65,39.1 28.86,38.31 28.86,36.05 25.57,32.77 25.57,31.42 22.97,28.81 20.94,28.81 17.43,25.31 v17.43,21.08
BG_LED5  (via drill 0.33)
  Top 0.203: v28.78,39.42 28.78,39.1 29.47,38.41 U5.41 | R13.2 16.08,21.32 v16.32,21.08
  Bottom 0.203: v16.32,21.08 16.32,24.96 20.69,29.32 22.72,29.32 25.07,31.67 25.07,32.94 28.42,36.3 28.42,39.06 v28.78,39.42
D2  (via drill 0.33, 0.33 pad 0.51)
  Top 0.203: v31.32,21 29.89,21 29.3,20.41 14.14,20.41 13.3,21.24 v13.3,21.28 | U5.25 35.94,32.78 v36.1,32.94
  Bottom 0.203: v36.1,32.94 35.8,32.94 35.61,32.75 34.1,32.75 31.32,29.97 31.32,23.54 31.24,23.46 31.24,21.08 v31.32,21
  Bottom 0.305: v13.3,21.28 11.4,23.19 11.4,37.55 9.04,39.91 J2.1
  Bottom 0.406: J2.1 8.67,40.4 v6.93,41.93
D3  (via drill 0.33)
  Top 0.203: 7.08,32.86 6.38,32.16 J3.1 | v31.72,40.93 32.04,41.24 32.51,41.24 33.31,40.45 33.31,39.18 32.67,38.54 32.19,38.54 31.93,38.28 U5.36
  Top 0.305: v16.73,36.54 15.56,36.54 13.57,34.56 10.95,34.56 9.26,32.86 7.08,32.86
  Bottom 0.203: v16.73,36.54 16.73,35.66 18.8,33.58 23.68,33.58 26.32,36.23 26.32,38.54 26.56,38.78 26.96,38.78 27.53,39.35 27.53,39.91 29.1,41.48 31.16,41.48 v31.72,40.93
  Bottom 0.254: 4.46,32.17 J3.1 3.39,33.24 v1.87,33.24
D4  (via drill 0.33, 0.33 pad 0.51)
  Top 0.203: v36.56,34.1 36.32,34.34 34.58,34.34 34.5,34.26 U5.28 | v11.95,19.65 12.35,19.65 12.51,19.49 29.69,19.49 29.89,19.69 v30.41,19.69
  Bottom 0.203: v36.56,34.1 36.36,34.3 34.22,34.3 30.37,30.45 30.37,24.02 30.21,23.86 30.21,21.8 30.05,21.64 30.05,20.05 v30.41,19.69
  Bottom 0.305: J5.1 8.2,16.24 10.37,16.24 11.95,17.83 v11.95,19.65
  Bottom 0.406: v3.91,12.97 J5.1
D5  (via drill 0.33, 0.33 pad 0.51)
  Top 0.203: v30.85,40.21 30.85,39.89 30.45,39.5 U5.39 | v13.05,16.38 13.07,16.4 13.07,17.03 13.38,17.35 14.57,17.35 15.57,18.34 v15.57,18.78
  Bottom 0.203: v30.85,40.21 30.05,41.01 29.34,41.01 27.99,39.66 27.99,36.56 24.57,33.15 24.57,31.88 22.51,29.81 20.37,29.81 15.57,25.01 v15.57,18.78
  Bottom 0.305: J6.1 13.94,9.08 13.94,13.94 13.05,14.83 v13.05,16.38
  Bottom 0.406: v10.79,5.3 J6.1
D6  (via drill 0.33, 0.33 pad 0.51)
  Top 0.203: v17.39,18.82 16,17.43 15.4,17.43 v14.45,16.48 | v25.96,30.12 27.31,30.12 27.47,30.29 27.83,30.29 27.99,30.45 U5.12
  Bottom 0.203: v25.96,30.12 25.68,30.12 23.38,27.83 21.56,27.83 19.65,25.92 19.65,19.89 18.58,18.82 v17.39,18.82
  Bottom 0.305: J7.1 20.8,10.13 19.49,11.44 17.99,11.44 14.45,14.98 v14.45,16.48
  Bottom 0.406: v20.19,1.11 J7.1
D7  (via drill 0.33, 0.33 pad 0.51)
  Top 0.203: v31.72,19.26 31.44,18.98 30.01,18.98 29.97,19.02 18.51,19.02 v16.1,16.61 | U5.27 34.9,33.76 v35.07,33.59
  Bottom 0.203: v35.07,33.59 34.23,33.59 30.85,30.21 30.85,23.78 30.69,23.62 30.69,21.48 30.61,21.4 30.61,20.53 30.85,20.29 31,20.29 31.4,19.89 31.4,19.57 v31.72,19.26
  Bottom 0.305: J8.1 29.94,6.96 26.51,10.38 21.58,10.38 19.81,12.15 18.34,12.15 16.1,14.4 v16.1,16.61
  Bottom 0.406: v30.52,1.14 J8.1
D8  (via drill 0.33, 0.33 pad 0.51)
  Top 0.203: v37.18,35.15 36.1,35.15 35.71,34.76 U5.29 | v28.78,18.34 28.58,18.54 18.74,18.54 17.11,16.92 v17.11,16.52
  Bottom 0.203: v37.18,35.15 36.5,35.15 36.12,34.77 33.9,34.77 29.89,30.77 29.89,24.26 29.73,24.1 29.73,22.11 28.78,21.16 v28.78,18.34
  Bottom 0.305: J9.1 38.06,7.59 33.81,11.84 21.19,11.84 20.13,12.91 18.62,12.91 17.11,14.41 v17.11,16.52
  Bottom 0.406: v39.95,5.3 J9.1
D9  (via drill 0.33, 0.33 pad 0.51)
  Top 0.203: v32.29,39.91 32.29,39.24 31.43,38.37 U5.37 | v18.11,16.53 19.42,17.84 v19.42,17.87
  Bottom 0.203: v32.29,39.91 32.29,39.2 29.73,36.64 29.73,35.53 26.56,32.35 26.56,30.57 26.64,30.49 26.64,29.58 26.08,29.02 25.29,29.02 23.62,27.35 21.8,27.35 20.21,25.77 20.21,18.66 v19.42,17.87
  Bottom 0.305: J10.1 43.06,15.72 39.99,15.72 36.93,12.65 21.53,12.65 20.57,13.62 18.94,13.62 18.11,14.45 v18.11,16.53
  Bottom 0.406: v46.86,12.97 J10.1
D10  (via drill 0.33, 0.33 pad 0.51)
  Top 0.203: v37.35,28.31 37.21,28.16 36.85,28.16 36.72,28.04 32.48,28.04 32.08,28.43 31.45,28.43 30.95,28.93 U5.18
  Top 0.305: J12.1 45.5,31.4 41.88,31.4 40.85,32.43 39.02,32.43 38.51,31.92 v37.43,31.92
  Bottom 0.203: v37.35,28.31 37.35,31.85 v37.43,31.92
  Bottom 0.406: J12.1 46.76,32.32 v48.94,33.06
D11  (via drill 0.33, 0.33 pad 0.51)
  Top 0.203: v36,28.7 35.97,28.67 34.64,28.67 34.51,28.54 32.73,28.54 32.42,28.86 31.72,28.86 31.43,29.15 U5.19
  Top 0.305: J13.1 38.78,37.16 38.78,34.37 v37.51,33.1
  Bottom 0.203: v36,28.7 36.32,28.7 36.76,29.14 36.76,32.35 v37.51,33.1
  Bottom 0.406: J13.1 42.06,40.4 v43.81,41.95
D+
  Top 0.203: R4.1 25.38,41.27 25.42,41.23 25.42,35.98 26.17,35.24 U5.4
D-
  Top 0.203: R5.1 26.7,41.7 25.88,40.89 25.88,36.28 26.43,35.74 U5.3
GND  (via drill 0.33, 0.33 pad 0.51)
  Top 0.203: C5.1 25.3,35.35 25.88,34.76 U5.5 | 28.54,36.42 28.54,34.76 28.28,34.76 | 32.45,36.76 32.45,34.77 28.29,34.77 | 29.42,28.7 29.47,28.76 U5.15 29.47,32.98 29.46,32.99
  Top 0.254: 34.77,31.46 34.43,31.8 U5.23 30.65,31.8 | 28.54,36.42 28.45,36.51 28.49,36.55 U5.43 | C2.1 29.31,28.59 29.42,28.7 | U5.35 32.41,36.8 32.45,36.76 32.49,36.72 U5.33 | U5.5 28.28,34.76 28.29,34.77 | v29.34,34.02 29.34,34.15 29.45,34.26
  Top 0.406: J15.GND 24.04,42.96 24.1,42.89
  Top 0.61: J4.1 6.95,23.46 | J14.1 32.99,42.43
  Bottom 0.254: 1.93,23.07 J4.1 3.02,22.57 v0.73,22.57
  Bottom 0.406: v35.48,48.03 J14.1
  other vias: 24.1,41.88 28.15,42.67 27.23,30.92 34.5,30.92 31,36.4 20.45,31.08 19.65,32.67 14.26,27.67 9.57,29.58 8.14,25.77 11.72,15.61 26.4,15.37 28.23,17.43 37.67,17.43 33.15,19.18 25.29,27.95 33.94,27.11 39.81,29.97 40.05,24.18
  pour Top (isolate 0.305): 50.77,25.37 arc90 25.37,50.77 arc90 -0.03,25.37 arc90 25.37,-0.03 arc90
  pour Bottom (isolate 0.305): 50.77,25.37 arc90 25.37,50.77 arc90 -0.03,25.37 arc90 25.37,-0.03 arc90
MISO  (via drill 0.33)
  Top 0.203: 19.02,39.21 TP1.P$1 20.45,37.91 20.45,34.81 20.69,34.58 20.69,32.04 21.56,31.16 23.07,31.16 23.58,31.68 23.78,31.68 26.44,31.68 26.56,31.8 U5.11
  other vias: 19.02,39.34
MOSI  (via drill 0.33)
  Top 0.203: TP2.P$1 21.56,40.69 20.69,39.81 20.69,38.86 20.88,38.66 20.88,35.01 21.12,34.77 21.12,32.23 21.76,31.6 22.87,31.6 23.38,32.12 26.24,32.12 26.43,32.3 U5.10
  other vias: 21.56,41.88
N$1
  Top 0.203: LED2.C 11.61,24.44 R6.1
N$2  (via drill 0.33)
  Top 0.254: S1.2 37.43,20.29 37.87,20.73 | 37.87,20.73 38.58,21.43 38.58,22.96 37.81,23.72 37.81,24.86 38.13,25.18 U2.3 | 37.87,20.73 38.31,20.29 TP8.P$1
  other vias: 38.7,20.29
N$3
  Top 0.203: LED1.A 31.12,9.9 R1.1
N$4
  Top 0.254: LED1.C 33.5,9.87 34,10.38 34,11.4 35.02,12.41 35.02,12.8 34.83,12.99 U1.1
N$5
  Top 0.203: Y1.1 32.03,27.68 31.72,27.99 31.13,27.99 30.45,28.67 U5.17
N$6
  Top 0.254: R2.2 29.31,15.12 29.31,14.07 30.38,12.99 U1.5
N$7
  Top 0.203: Y1.3 29.63,27.57 29.95,27.88 U5.16
N$8
  Top 0.203: R16.1 24.95,22.76 26.09,23.91 D10.2
N$9
  Top 0.203: LED7.A R11.1
N$10
  Top 0.203: LED6.A R10.1
N$11
  Top 0.203: LED5.A R9.1
N$12
  Top 0.203: LED8.A R12.1
N$13
  Top 0.203: LED9.A R13.1
N$14
  Top 0.203: R15.1 23.96,23.28 D10.3
N$15
  Top 0.203: R14.1 26.38,25.58 26.09,25.87 D10.1
N$18
  Top 0.203: LED4.A R8.1
N$19
  Top 0.203: J15.D- 25.99,44.83 26.7,44.12 R5.2
N$20
  Top 0.203: R4.2 25.37,43.59 25.37,43.98 25.34,44.01 J15.D+
N$21
  Top 0.203: LED3.C 10.13,22.99 10.37,22.75 R7.1
RESET  (via drill 0.33)
  Top 0.203: S2.4 S2.3 16.11,32.11 R3.2 16.11,35.26 v15.97,35.4 | v18.51,32.24 18.51,30.08 19.34,29.26 26.88,29.26 27.04,29.42 27.23,29.42 27.69,29.87 28.09,29.87 28.49,30.27 U5.13
  Bottom 0.203: TP4.P$1 21.56,36.8 20.29,36.8 19.27,37.81 16.86,37.81 15.97,36.93 v15.97,35.4 15.97,32.78 16.51,32.24 v18.51,32.24
  other vias: 24.1,39.34
RGB_B  (via drill 0.33)
  Top 0.203: v35.53,36.93 35.02,36.93 34.31,36.22 U5.32 | R15.2 22.99,25.19 v23.37,25.57
  Bottom 0.203: v35.53,36.93 33.75,36.93 28.46,31.64 28.46,26.56 27.48,25.57 v23.37,25.57
RGB_G  (via drill 0.33)
  Top 0.203: v36.42,36.16 34.85,36.16 34.43,35.74 U5.31 | v27.19,22.59 R16.2
  Bottom 0.203: v36.42,36.16 33.78,36.16 28.94,31.32 28.94,26.24 27.19,24.5 v27.19,22.59
RGB_R  (via drill 0.33)
  Top 0.203: 35.1,35.26 v35.29,35.45 35.08,35.24 U5.30 | R14.2 28.86,23.88 v28.86,23.86
  Bottom 0.203: v35.29,35.45 33.86,35.45 29.42,31 29.42,25.92 28.86,25.37 v28.86,23.86
RX_LED  (via drill 0.33)
  Top 0.203: v13.3,28.7 13.07,28.46 R6.2 | v22.3,32.77 22.53,32.99 25.69,32.99 25.98,33.28 U5.8
  Bottom 0.203: v13.3,28.7 14.97,30.37 18.62,30.37 20.21,31.96 21.45,31.96 22.26,32.77 v22.3,32.77
SCK  (via drill 0.33)
  Top 0.203: TP3.P$1 21.32,39.1 21.32,35.21 21.56,34.97 21.56,32.43 21.96,32.04 22.67,32.04 23.19,32.55 25.96,32.55 26.19,32.78 U5.9
  other vias: 21.56,39.34
TX_LED  (via drill 0.33)
  Top 0.203: v34.39,29.56 33.46,30.48 33.09,30.48 32.91,30.67 U5.22 | v33.07,20.53 32.83,20.29 30.96,20.29 30.85,20.41 29.93,20.41 29.5,19.97 13.46,19.97 12.59,20.84 12.59,21.68 12.99,22.07 12.99,22.57 R7.2
  Bottom 0.203: v34.39,29.56 34.39,29.23 33.94,28.78 33.54,28.78 32.99,28.23 32.99,23.46 33.31,23.15 33.31,22.43 33.07,22.19 v33.07,20.53
V_BATT  (via drill 0.33)
  Top 0.61: 17.75,12.41 19.4,12.41 22.56,15.57 J16.2 24.37,16.8 v24.4,16.83 | 17.75,12.41 14.32,12.41 13.43,13.3 13.43,14.45 13.81,14.83 D1.A | U1.3 35.73,14.89 TP7.P$1 | C8.2 17.85,12.31 17.75,12.41
  Bottom 0.61: v24.4,16.83 24.83,16.4 31.16,16.4 33.12,14.45 36.16,14.45 TP7.P$1
  other vias: 36.16,14.45
VCC_1  (via drill 0.33)
  Top 0.203: v22.07,35.53 22.51,35.08 22.51,34.02 23.11,33.43 25.37,33.43 25.7,33.76 | U5.7 25.7,33.76 | 25.7,33.76
  Top 0.254: R1.2 32.99,11.69 32.99,13.43 32.23,14.19 32.23,14.7 32.04,14.89 U1.4 | 34.82,17.75 S1.1
  Top 0.406: U2.1 36.73,27.08 v36.67,27.02 | J15.VBUS 26.64,45.17 27.06,44.75 29.16,44.75 29.31,44.61 | C7.2 29.31,44.61 | 29.31,44.61 | 29.31,44.61 v29.31,44.65
  Top 0.61: D1.C 20.29,14.83 20.8,15.34 20.8,16.22 v21.56,16.99 | v30.32,14.57 30.64,14.89 U1.4 | 32.04,14.89 32.04,16.8 32.99,17.75 34.26,17.75 | 34.26,17.75 34.82,17.75 | S1.1 34.3,17.79 34.26,17.75
  Bottom 0.254: v22.07,35.53 22.07,35.66 24.86,38.45 24.86,38.96 26.42,40.51 27.43,40.51 29.79,42.87 30.17,42.87
  Bottom 0.61: v21.56,16.99 22.32,16.99 22.61,16.7 22.61,15.94 24.23,14.32 30.07,14.32 v30.32,14.57 | S1.1 35.4,18.33 35.4,22.57 36.67,23.84 v36.67,27.02 37.5,27.02 38.47,27.99 38.47,31.72 38.62,31.88 38.62,34.73 38.23,35.13 38.23,36.56 37.67,37.12 36.88,37.12 35.77,38.23 34.58,38.23 33.39,39.42 33.39,40.69 31.88,42.2 30.85,42.2 30.17,42.87 29.31,43.74 v29.31,44.65
  other vias: 34.86,17.79

### Text on the board
Bottom: v10
tPlace: - | + | A2 | 11 | SDA | RESET | R:12 | ~10 | A3 | G:13 | B:14 | SCL | OFF | - | + | TX | RX | 15 | 16 | 17 | 18 | 19 | 20 | A4 | ON | A9 | A5 | ~A8 | CHG | ~6 | ~A7
bPlace: - | + | A2 | 11 | SDA | ~10 | A3 | SCL | - | + | A4 | A9 | A5 | ~A8 | ~6 | ~A7
Measures: Inches
tDocu: Marshall Taylor | Revised by: Elias Santistevan | LilyPad concept and shapes by: L. Buechley and N. Seidle | PCB thickness: 31 mil / 0.8mm | Solder mask color: Purple (Lilypad) | Finishing: Lead-free HASL | Unplated holes: / 0.013 | Plated holes: / 0.11
bDocu: Marshall Taylor | Marshall Taylor | Marshall Taylor | Revised by: Elias Santistevan | Revised by: Elias Santistevan | Revised by: Elias Santistevan | LilyPad concept and shapes by: L. Buechley and N. Seidle | LilyPad concept and shapes by: L. Buechley and N. Seidle | LilyPad concept and shapes by: L. Buechley and N. Seidle | Marshall Taylor | Revised by: Elias Santistevan | LilyPad concept and shapes by: L. Buechley and N. Seidle | PCB thickness: 31 mil / 0.8mm | PCB thickness: 31 mil / 0.8mm | PCB thickness: 31 mil / 0.8mm | PCB thickness: 31 mil / 0.8mm | Solder mask color: Purple (Lilypad) | Solder mask color: Purple (Lilypad) | Solder mask color: Purple (Lilypad) | Solder mask color: Purple (Lilypad) | Finishing: Lead-free HASL | Finishing: Lead-free HASL | Finishing: Lead-free HASL | Finishing: Lead-free HASL | Plated holes: / 0.11 | Unplated holes: / 0.013 | Plated holes: / 0.013 / 0.026 / 0.0276 / 0.0866 / 0.11 / 0.1575 | Unplated holes: / 0.015 / 0.02 / 0.315 / 0.0335 | Plated holes: / 0.11 | Plated holes: / 0.11 | Unplated holes: / 0.013 | Unplated holes: / 0.013